# Altium schematic sheet 4-.SchDoc
size A4; SheetNumber: 4; SheetTotal: 5
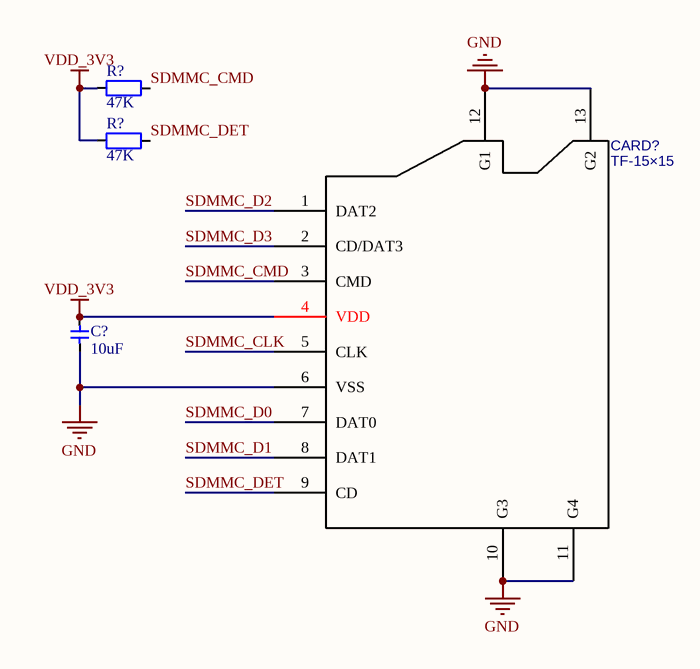
[diagram p0: 4-.SchDoc]

## Parts
(Parts that share a designator on the sheet are numbered #1, #2 ... from top to bottom, then left to right.)
C?  10uF  [CAP_0402]
CARD?  TF-15×15  [TF-SMD_TF-15-15]
R?#1  47K  [RES_0402]
R?#2  47K  [RES_0402]

## Nets
GND: C?.1 CARD?.6(VSS) CARD?.10(G3) CARD?.11(G4) CARD?.12(G1) CARD?.13(G2)
VDD_3V3: C?.2 CARD?.4(VDD) R?#1.1 R?#2.1
SDMMC_CLK: CARD?.5(CLK)
SDMMC_CMD: CARD?.3(CMD) R?#1.2
SDMMC_D0: CARD?.7(DAT0)
SDMMC_D1: CARD?.8(DAT1)
SDMMC_D2: CARD?.1(DAT2)
SDMMC_D3: CARD?.2(CD/DAT3)
SDMMC_DET: CARD?.9(CD) R?#2.2

## Library data of the parts
C? = 电容-0402: Capacitor; Value: 0.1u
CARD? = TF-15×15: TF卡卡座 https://item.szlcsc.com/112422.html; BOM_Manufacturer: SOFNG; BOM_Supplier: LCSC; BOM_Manufacturer Part: TF-15×15; BOM_Supplier Part: C111196; BOM_JLCPCB Part Class: Extended Part; spicePre: C; spiceSymbolName: TF-15×15
R?#1 R?#2 = 电阻-0402: Resistor; Value: 22R